# Altium schematic sheet schematic.SchDoc
size A4
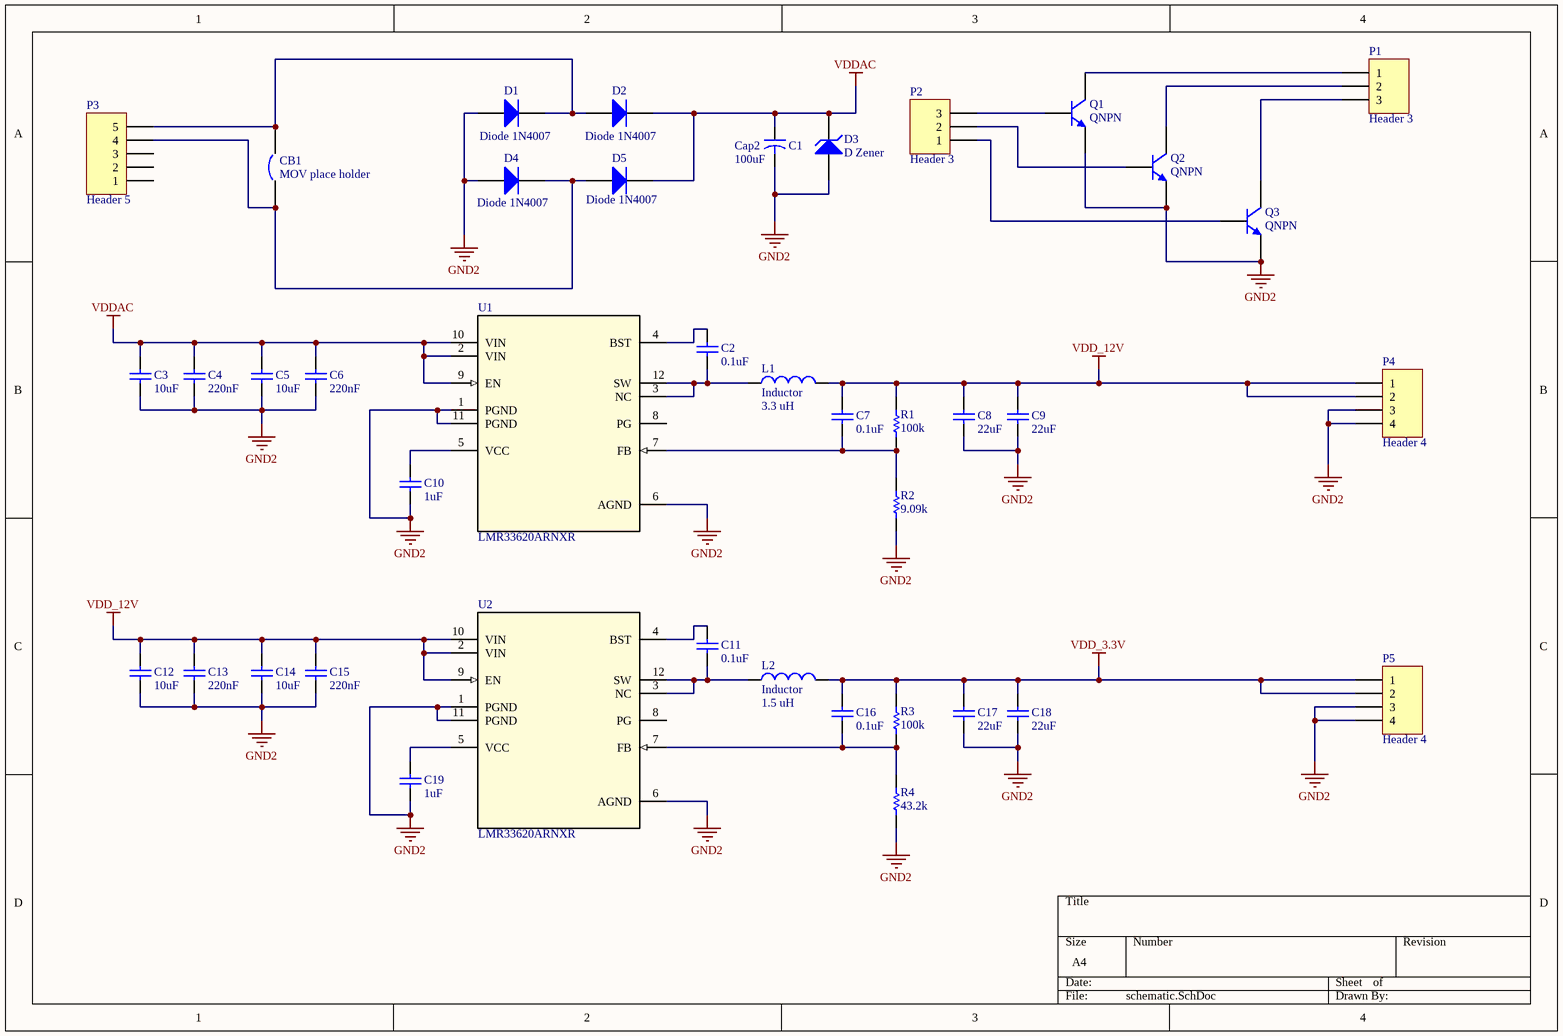
[diagram p0: schematic.SchDoc]

## Parts
C1  Cap2  value 100uF  [CAPR5-4X5]
C2  value 0.1uF  [C_0402]
C3  value 10uF  [CAPC1608X05N]
C4  value 220nF  [C_0402]
C5  value 10uF  [CAPC1608X05N]
C6  value 220nF  [C_0402]
C7  value 0.1uF  [C_0402]
C8  value 22uF  [CAPC1608X05N]
C9  value 22uF  [CAPC1608X05N]
C10  value 1uF  [C_0402]
C11  value 0.1uF  [C_0402]
C12  value 10uF  [CAPC1608X05N]
C13  value 220nF  [C_0402]
C14  value 10uF  [CAPC1608X05N]
C15  value 220nF  [C_0402]
C16  value 0.1uF  [C_0402]
C17  value 22uF  [CAPC1608X05N]
C18  value 22uF  [CAPC1608X05N]
C19  value 1uF  [C_0402]
CB1  MOV place holder  [mov]
D1  Diode 1N4007  [DO-41]
D2  Diode 1N4007  [DO-41]
D3  D Zener  [DIODE]
D4  Diode 1N4007  [DO-41]
D5  Diode 1N4007  [DO-41]
L1  Inductor  value 3.3 uH  [INDC2016X10N]
L2  Inductor  value 1.5 uH  [INDC2016X10N]
P1  Header 3  [HDR1X3]
P2  Header 3  [HDR1X3]
P3  Header 5  [edge]
P4  Header 4  [HDR1X4]
P5  Header 4  [HDR1X4]
Q1  QNPN  [SOT-23B_N]
Q2  QNPN  [SOT-23B_N]
Q3  QNPN  [SOT-23B_N]
R1  Res1  [R_0402]  (value not drawn)
R2  Res1  [R_0402]  (value not drawn)
R3  Res1  [R_0402]  (value not drawn)
R4  Res1  [R_0402]  (value not drawn)
U1  LMR33620ARNXR  [RNX0012B]
U2  LMR33620ARNXR  [RNX0012B]

## Nets
GND2: C1.2 C3.1 C4.1 C5.1 C6.1 C8.1 C9.1 C10.1 C12.1 C13.1 C14.1 C15.1 C17.1 C18.1 C19.1 D1.1(A) D3.1(A) D4.1(A) P4.3 P4.4 P5.3 P5.4 Q1.2(E) Q2.2(E) Q3.2(E) R2.2 R4.2 U1.1(PGND) U1.6(AGND) U1.11(PGND) U2.1(PGND) U2.6(AGND) U2.11(PGND)
VDD_3.3V: C16.2 C17.2 C18.2 L2.2 P5.1 P5.2 R3.1
VDD_12V: C7.2 C8.2 C9.2 C12.2 C13.2 C14.2 C15.2 L1.2 P4.1 P4.2 R1.1 U2.2(VIN) U2.9(EN) U2.10(VIN)
VDDAC: C1.1 C3.2 C4.2 C5.2 C6.2 D2.2(K) D3.2(K) D5.2(K) U1.2(VIN) U1.9(EN) U1.10(VIN)
NetC2_1: C2.1 L1.1 U1.3(NC) U1.12(SW)
NetC2_2: C2.2 U1.4(BST)
NetC7_1: C7.1 R1.2 R2.1 U1.7(FB)
NetC10_2: C10.2 U1.5(VCC)
NetC11_1: C11.1 L2.1 U2.3(NC) U2.12(SW)
NetC11_2: C11.2 U2.4(BST)
NetC16_1: C16.1 R3.2 R4.1 U2.7(FB)
NetC19_2: C19.2 U2.5(VCC)
NetCB1_1: CB1.1 D4.2(K) D5.1(A) P3.4
NetCB1_2: CB1.2 D1.2(K) D2.1(A) P3.5
NetP1_1: P1.1 Q1.3(C)
NetP1_2: P1.2 Q2.3(C)
NetP1_3: P1.3 Q3.3(C)
NetP2_1: P2.1 Q3.1(B)
NetP2_2: P2.2 Q2.1(B)
NetP2_3: P2.3 Q1.1(B)

Not connected (* = marked no-connect by the designer): P3 1 2 3; U1 8(PG); U2 8(PG)

## Notes on the sheet
- (in symbol Res1) 100k; 9.09k; 43.2k

## Library data of the parts
C1 = Cap2: Capacitor; Published: 23-Sep-2002; PackageReference: CAPR5-4X5; Publisher: Altium Limited; PackageDescription: Capacitor; 2 Leads
C2-C19 = Cap
CB1 = Circuit Breaker: Published: 24-Mar-1999; LatestRevisionDate: 17-Jul-2002; LatestRevisionNote: Re-released for DXP Platform.; PackageReference: SPST-2; Publisher: Altium Limited; PackageDescription: Switch; 2 Leads
D1 D2 D4 D5 = Diode 1N4007: 1 Amp General Purpose Rectifier; Published: 8-Jun-2000; LatestRevisionDate: 17-Jul-2002; LatestRevisionNote: Re-released for DXP Platform.; DatasheetVersion: 1998; PackageVersion: Aug-1999; PackageReference: DO-41; Publisher: Altium Limited; PackageDescription: Diode, Axial; Body 5.2 x 2.7 mm (LxDia. max), Lead Dia. 0.86 mm (max); Code_JEDEC: DO-204-AL; ComponentLink1Description: Manufacturer Link; ComponentLink1URL: http://www.fairchildsemi.com/; ComponentLink2Description: Datasheet; ComponentLink2URL: http://www.fairchildsemi.com/ds/1N%2F1N4001.pdf
D3 = D Zener: Zener Diode; Published: 8-Jun-2000; LatestRevisionDate: 17-Jul-2002; LatestRevisionNote: Re-released for DXP Platform.; PackageReference: DIODE-0.7; Publisher: Altium Limited; PackageDescription: Diode, Thru-Hole; 2 Leads; 0.7 in Pin Spacing
L1 L2 = Inductor: Code_IEC: 1005; Published: 8-Jun-2000; LatestRevisionDate: 29-May-2009; LatestRevisionNote: IPC-7351 Footprint Added.; PackageReference: 0402-A; Publisher: Altium Limited; PackageDescription: Chip Inductor; Code_JEITA: 0402
P1 P2 = Header 3: Header, 3-Pin; LatestRevisionDate: 17-Jul-2002; LatestRevisionNote: Re-released for DXP Platform.; Publisher: Altium Limited
P3 = Header 5: Header, 5-Pin; LatestRevisionDate: 17-Jul-2002; LatestRevisionNote: Re-released for DXP Platform.; Publisher: Altium Limited
P4 P5 = Header 4: Header, 4-Pin; LatestRevisionDate: 17-Jul-2002; LatestRevisionNote: Re-released for DXP Platform.; Publisher: Altium Limited
Q1-Q3 = QNPN: NPN Bipolar Transistor; Published: 8-Jun-2000; LatestRevisionDate: 29-May-2009; LatestRevisionNote: IPC-7351 Footprint Added.; PackageVersion: Aug-1999; PackageReference: SOT-23B; Publisher: Altium Limited; PackageDescription: 3-Pin SOT-23 Package 0.95 mm Pitch, 2.4 mm Lead Span
R1-R4 = Res1: Resistor
U1 U2 = LMR33620ARNXR: Imported; Manufacturer: Texas Instruments; PartNumber: LMR33620ARNXR; RefDes: RefDes; TYPE: TYPE; Value: Value